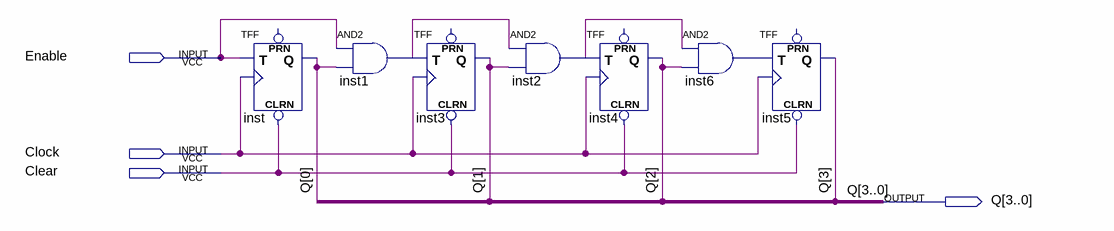
[diagram p0: schematic sheet]
// Quartus schematic BODEM4BIT.bdf as structural Verilog: 7 symbols, 4 pins
module BODEM4BIT (
  input  Enable,
  input  Clock,
  input  Clear,
  output [3:0] Q
);

  wire inst1_out, inst2_out, inst6_out;

  TFF inst (.CLRN(Clear), .T(Enable), .CLK(Clock), .Q(Q[0]));  // open: PRN
  and inst1 (inst1_out, Enable, Q[0]);
  TFF inst3 (.CLRN(Clear), .T(inst1_out), .CLK(Clock), .Q(Q[1]));  // open: PRN
  and inst2 (inst2_out, inst1_out, Q[1]);
  TFF inst4 (.CLRN(Clear), .T(inst2_out), .CLK(Clock), .Q(Q[2]));  // open: PRN
  and inst6 (inst6_out, inst2_out, Q[2]);
  TFF inst5 (.CLRN(Clear), .T(inst6_out), .CLK(Clock), .Q(Q[3]));  // open: PRN
endmodule
